# EAGLE schematic CEM-16bit-PCF8575 (EAGLE 6.1)
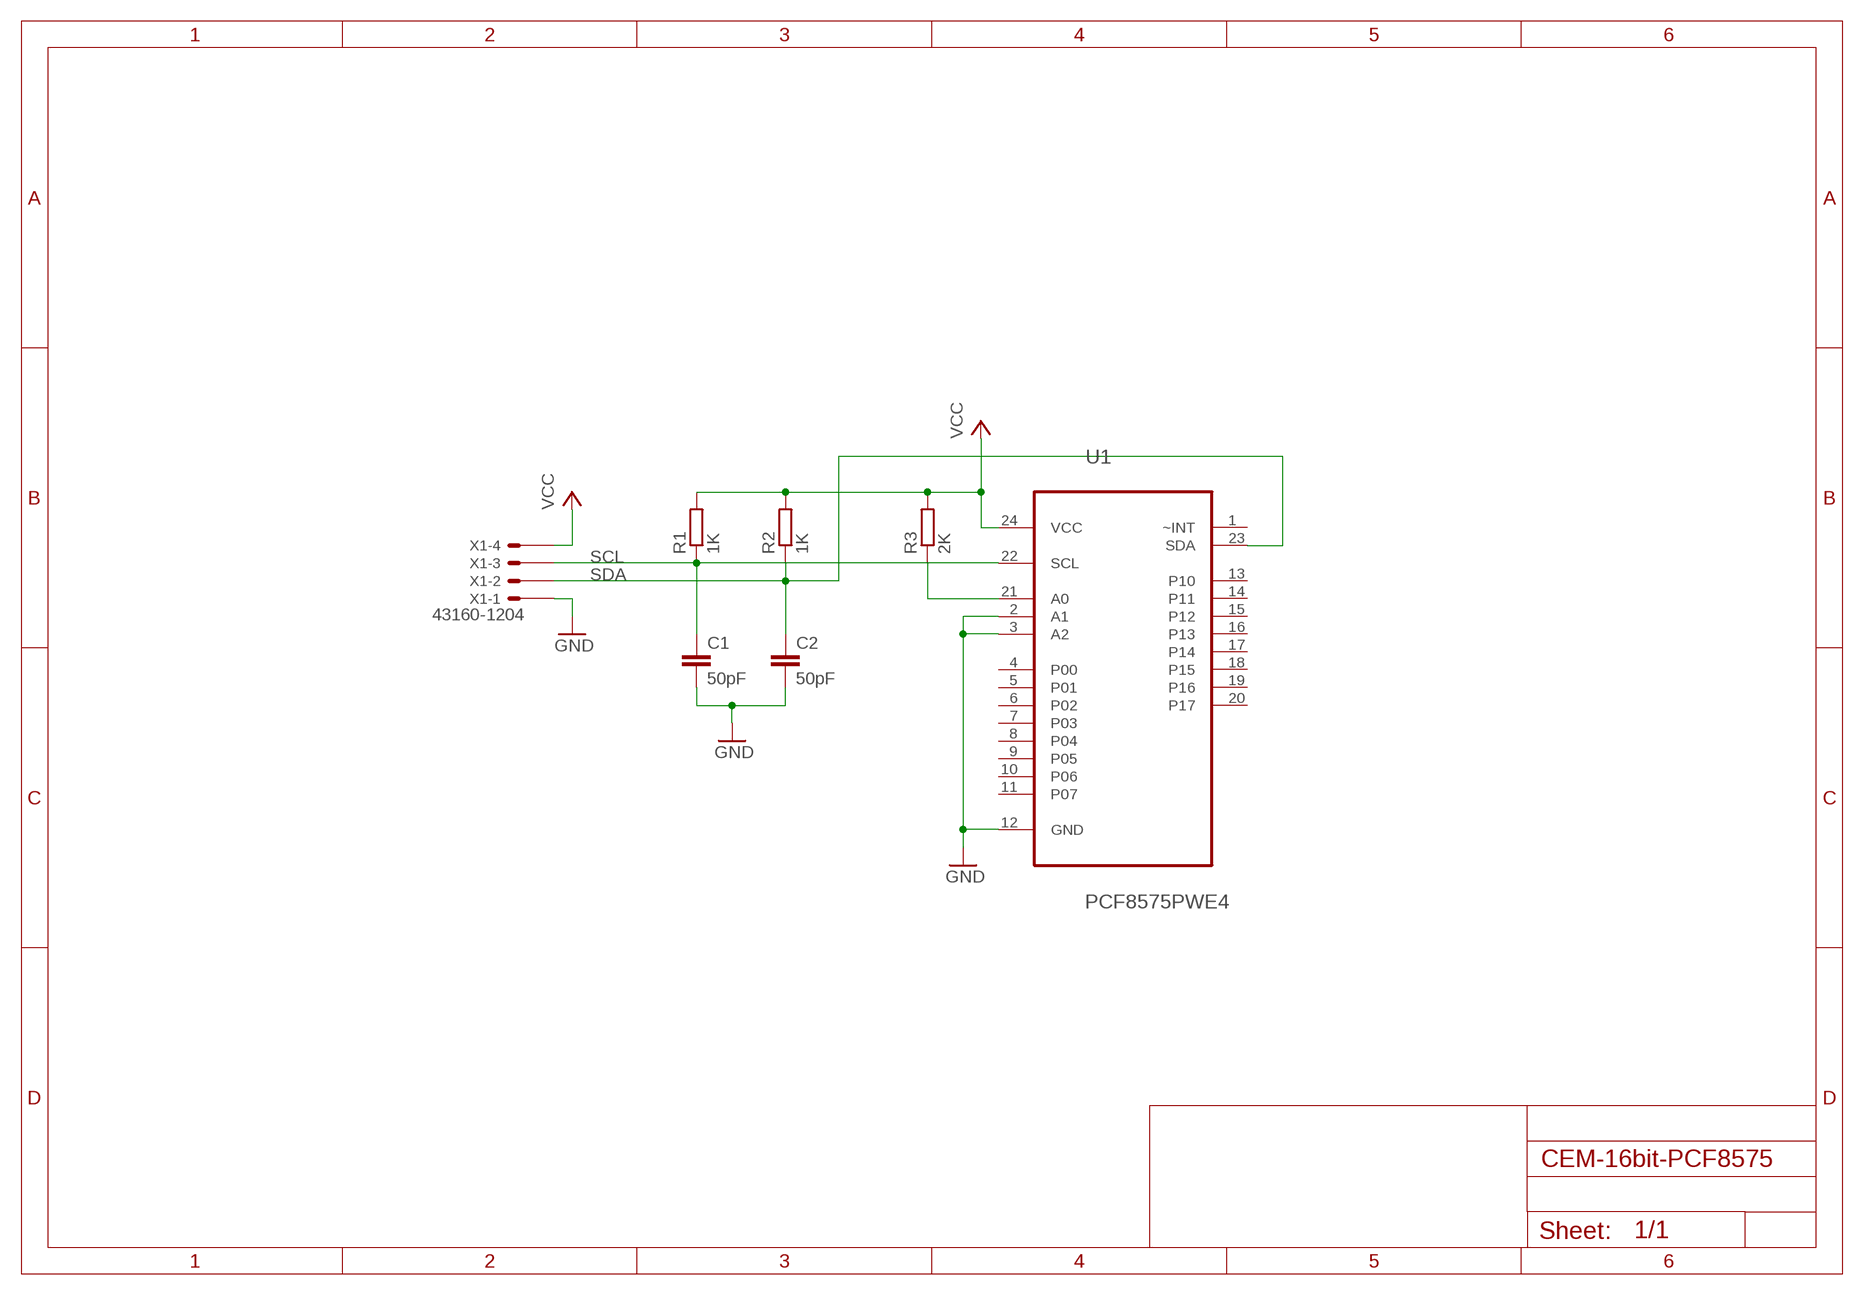
[diagram p0: schematic, sheet 1]

## Parts
C1  50pF  C-EUC1206K  [C1206K]
C2  50pF  C-EUC1206K  [C1206K]
R1  1K  R-EU_M1406  [M1406]
R2  1K  R-EU_M1406  [M1406]
R3  2K  R-EU_M1406  [M1406]
U1  PCF8575PWE4  [SOP65P640X120-24N]
X1  43160-1204  [43160-XX04]

## Nets
GND: C1.2 C2.2 U1.2(A1) U1.3(A2) U1.12(GND) X1.1@1(-1:S)
N$3: R3.1 U1.21(A0)
SCL: C1.1 R1.1 U1.22(SCL) X1.3@1(-3:S)
SDA: C2.1 R2.1 U1.23(SDA) X1.2@1(-2:S)
VCC: R1.2 R2.2 R3.2 U1.24(VCC) X1.4@1(-4:S)
Unconnected: U1.1(~INT) U1.4(P00) U1.5(P01) U1.6(P02) U1.7(P03) U1.8(P04) U1.9(P05) U1.10(P06) U1.11(P07) U1.13(P10) U1.14(P11) U1.15(P12) U1.16(P13) U1.17(P14) U1.18(P15) U1.19(P16) U1.20(P17) X1.1@2(-1:S) X1.2@2(-2:S) X1.3@2(-3:S) X1.4@2(-4:S)

## Library data of the parts
C1 C2 = rcl:C-EU: CAPACITOR, European symbol
R1-R3 = resistor:R-EU_: RESISTOR, European symbol
U1 = PCF8575:PCF8575PWE4: REMOTE 16-BIT I2C AND SMBus I/O EXPANDER; MPN: PCF8575PWE4; OC_FARNELL: 1053546; OC_NEWARK: 97K6983; PACKAGE: TSSOP-24; SUPPLIER: Texas Instruments
X1 = con-molex:43160-*04: SDA-43160 Connector Source: http://www.molex.com/pdm_docs/sd/431601306_sd.pdf; OC_FARNELL: unknown; OC_NEWARK: unknown